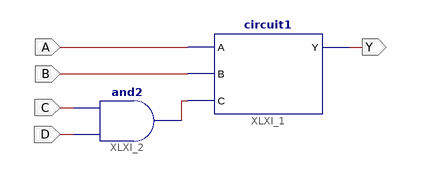
[diagram p0: schematic sheet 1]
// Xilinx ISE schematic circuit2.sch (spartan3e) as structural Verilog: 2 symbols, 5 ports
module circuit2 (
  input  A,
  input  B,
  input  C,
  input  D,
  output Y
);

  wire XLXN_3;

  circuit1 XLXI_1 (.A(A), .B(B), .C(XLXN_3), .Y(Y));
  and XLXI_2 (XLXN_3, D, C);
endmodule
